# EAGLE schematic garage (EAGLE 9.6.2)
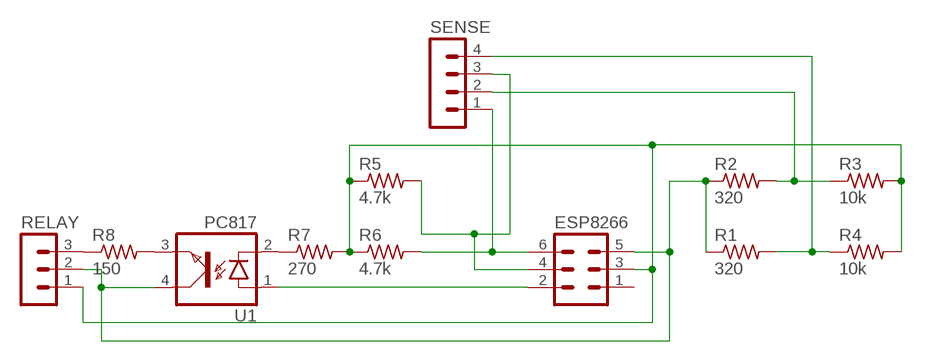
[diagram p0: schematic, sheet 1]

## Parts
ESP8266  MA03-2  [MA03-2]
R1  320  R-US_0207/2V  [0207/2V]
R2  320  R-US_0207/2V  [0207/2V]
R3  10k  R-US_0207/2V  [0207/2V]
R4  10k  R-US_0207/2V  [0207/2V]
R5  4.7k  R-US_0207/2V  [0207/2V]
R6  4.7k  R-US_0207/2V  [0207/2V]
R7  270  R-US_0207/2V  [0207/2V]
R8  150  R-US_0207/2V  [0207/2V]
RELAY  MA03-1  [MA03-1]
SENSE  MA04-1  [MA04-1]
U1  PC817  [DIL04]

## Nets
N$1: ESP8266.2 U1.1(A)
N$2: ESP8266.6 R6.2 SENSE.1
N$3: R8.1 RELAY.3
N$4: R2.2 R3.1 SENSE.2
N$5: R1.2 R4.1 SENSE.4
N$6: ESP8266.3 R3.2 R4.2 R5.1 R6.1 R7.2 RELAY.1
N$7: ESP8266.5 R1.1 R2.1 RELAY.2 U1.4(COL)
N$8: R7.1 U1.2(C)
N$9: ESP8266.4 R5.2 SENSE.3
N$10: R8.2 U1.3(EMIT)
Unconnected: ESP8266.1

## Library data of the parts
ESP8266 = con-lstb:MA03-2: PIN HEADER; OC_FARNELL: unknown; OC_NEWARK: unknown
R1-R8 = adafruit:R-US_: RESISTOR, American symbol
RELAY = con-lstb:MA03-1: PIN HEADER; OC_FARNELL: unknown; OC_NEWARK: unknown
SENSE = con-lstb:MA04-1: PIN HEADER; OC_FARNELL: unknown; OC_NEWARK: unknown
U1 = optocoupler:PC817: SHARP OPTO COUPLER; MPN: PC817X4J000F; OC_FARNELL: 9707727; OC_NEWARK: 97K7059